# Altium schematic sheet PCIE Connector.SchDoc
size 420 x 297 mm; Author: ALTIUM GOSTBOM2.0 KEV; SheetNumber: 16; SheetTotal: 48
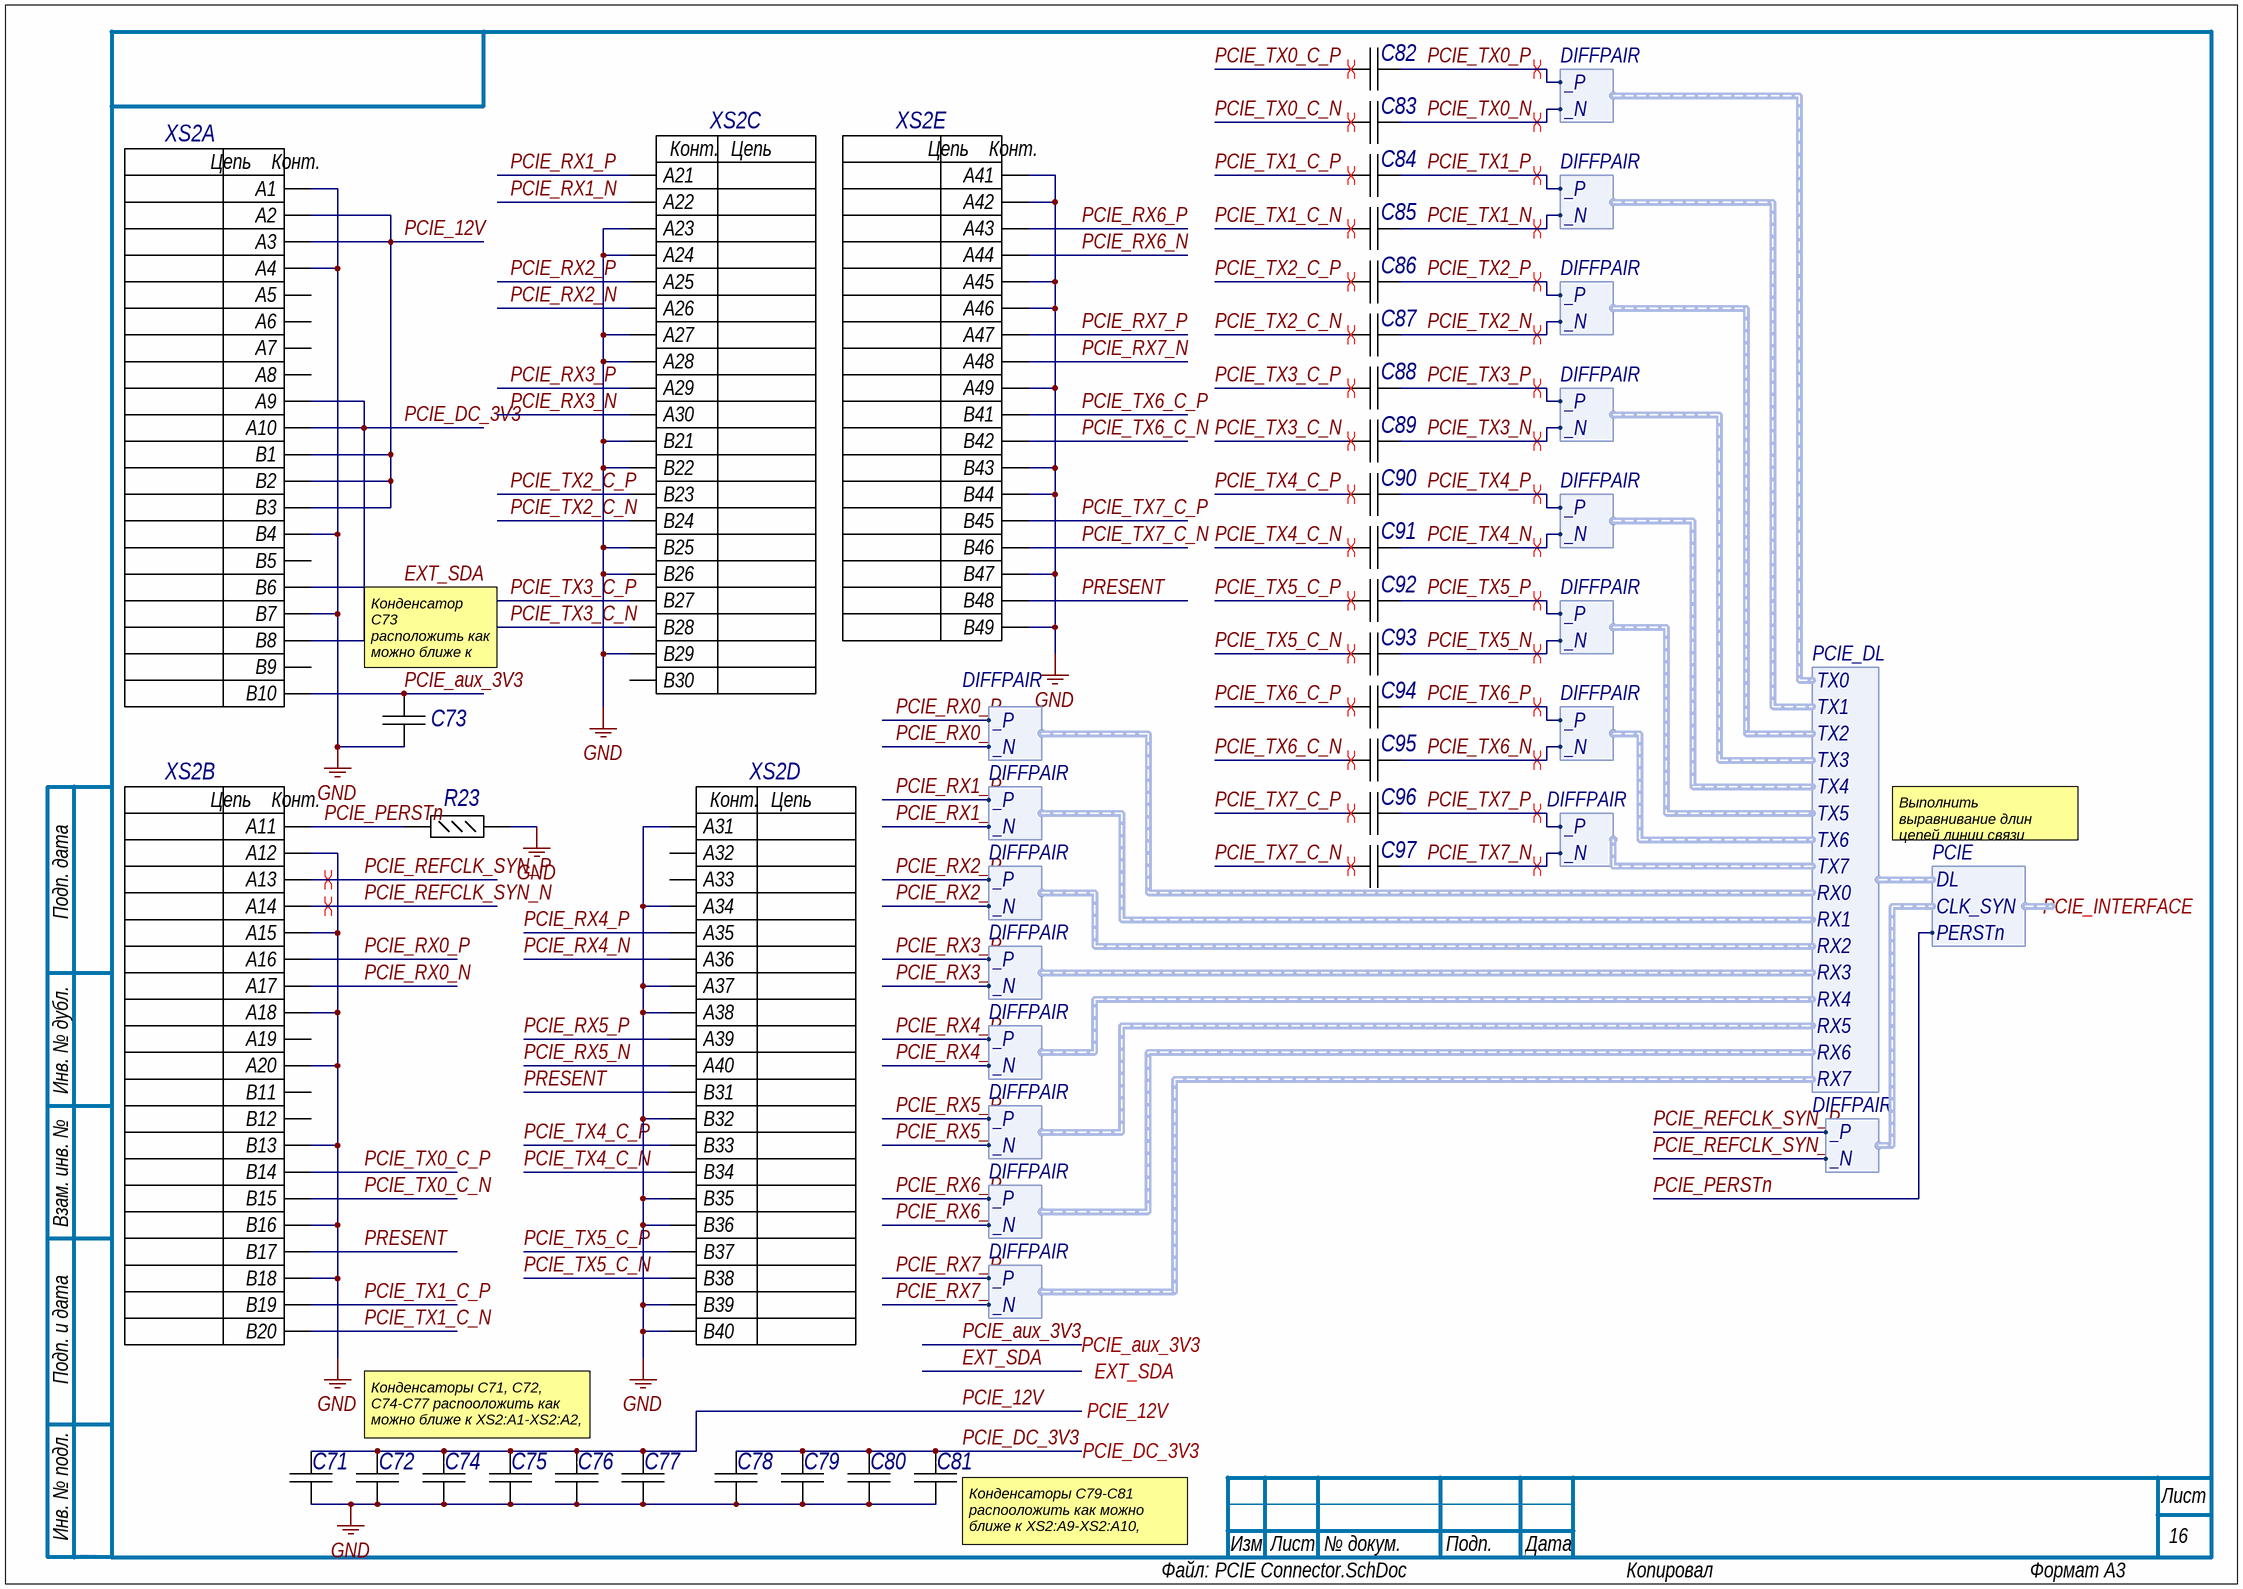
[diagram p0: PCIE Connector.SchDoc]

## Parts
C71  GRM31CR61E226KE15L  [CAPC3216X180X55ML20T25]  (value not drawn)
C72  C1005X7R1E104M  [CAPC1005X55X10LL05]  (value not drawn)
C73  C1005X7R1E104M  [CAPC1005X55X10LL05]  (value not drawn)
C74  C1005X7R1E104M  [CAPC1005X55X10LL05]  (value not drawn)
C75  C1005X7R1E104M  [CAPC1005X55X10LL05]  (value not drawn)
C76  C1005X7R1E104M  [CAPC1005X55X10LL05]  (value not drawn)
C77  C1005X7R1E104M  [CAPC1005X55X10LL05]  (value not drawn)
C78  C1005X7R1E104M  [CAPC1005X55X10LL05]  (value not drawn)
C79  C1005X7R1E104M  [CAPC1005X55X10LL05]  (value not drawn)
C80  C1005X7R1E104M  [CAPC1005X55X10LL05]  (value not drawn)
C81  GRM31CR60J107ME39L  [CAPC3216X190X55ML30T25]  (value not drawn)
C82  GRM155R61A224KE19D  [CAPC1005X55X25NL05T10]  (value not drawn)
C83  GRM155R61A224KE19D  [CAPC1005X55X25NL05T10]  (value not drawn)
C84  GRM155R61A224KE19D  [CAPC1005X55X25NL05T10]  (value not drawn)
C85  GRM155R61A224KE19D  [CAPC1005X55X25NL05T10]  (value not drawn)
C86  GRM155R61A224KE19D  [CAPC1005X55X25NL05T10]  (value not drawn)
C87  GRM155R61A224KE19D  [CAPC1005X55X25NL05T10]  (value not drawn)
C88  GRM155R61A224KE19D  [CAPC1005X55X25NL05T10]  (value not drawn)
C89  GRM155R61A224KE19D  [CAPC1005X55X25NL05T10]  (value not drawn)
C90  GRM155R61A224KE19D  [CAPC1005X55X25NL05T10]  (value not drawn)
C91  GRM155R61A224KE19D  [CAPC1005X55X25NL05T10]  (value not drawn)
C92  GRM155R61A224KE19D  [CAPC1005X55X25NL05T10]  (value not drawn)
C93  GRM155R61A224KE19D  [CAPC1005X55X25NL05T10]  (value not drawn)
C94  GRM155R61A224KE19D  [CAPC1005X55X25NL05T10]  (value not drawn)
C95  GRM155R61A224KE19D  [CAPC1005X55X25NL05T10]  (value not drawn)
C96  GRM155R61A224KE19D  [CAPC1005X55X25NL05T10]  (value not drawn)
C97  GRM155R61A224KE19D  [CAPC1005X55X25NL05T10]  (value not drawn)
R23  ERJ-2RKF4701X  [RESC1005X40X25LL05T05]  (value not drawn)
XS2  PCIE-098-02-F-D-TH  [SMTC-PCIE-098-02-F-D-TH_V]  (value not drawn)  (parts A,B,C,D,E of 5)

## Ports
EXT_SDA, PCIE_12V, PCIE_aux_3V3, PCIE_DC_3V3, PCIE_INTERFACE (harness PCIE)

## Harnesses
PCIE_DL: RX0, RX1, RX2, RX3, RX4, RX5, RX6, RX7, TX0, TX1, TX2, TX3, TX4, TX5, TX6, TX7
DIFFPAIR: _P, _N
PCIE: DL, CLK_SYN, PERSTn

## Nets
GND: C71.1 C72.1 C73.1 C74.1 C75.1 C76.1 C77.1 C78.1 C79.1 C80.1 C81.1 R23.2 XS2.A1 XS2.A4 XS2.A12 XS2.A15 XS2.A18 XS2.A20 XS2.A23 XS2.A24 XS2.A27 XS2.A28 XS2.A31 XS2.A34 XS2.A37 XS2.A38 XS2.A41 XS2.A42 XS2.A45 XS2.A46 XS2.A49 XS2.B4 XS2.B7 XS2.B13 XS2.B16 XS2.B18 XS2.B21 XS2.B22 XS2.B25 XS2.B26 XS2.B29 XS2.B32 XS2.B35 XS2.B36 XS2.B39 XS2.B40 XS2.B43 XS2.B44 XS2.B47 XS2.B49
EXT_SDA: XS2.B6 ; port EXT_SDA
PCIE_12V: C71.2 C72.2 C74.2 C75.2 C76.2 C77.2 XS2.A2 XS2.A3 XS2.B1 XS2.B2 XS2.B3 ; port PCIE_12V
PCIE_aux_3V3: C73.2 XS2.B10 ; port PCIE_aux_3V3
PCIE_DC_3V3: C78.2 C79.2 C80.2 C81.2 XS2.A9 XS2.A10 XS2.B8 ; port PCIE_DC_3V3
PCIE_PERSTn: R23.1 XS2.A11 ; port PCIE_INTERFACE.PERSTn
PCIE_REFCLK_SYN_N: XS2.A14 ; harness DIFFPAIR._N
PCIE_REFCLK_SYN_P: XS2.A13 ; harness DIFFPAIR._P
PCIE_RX0_N: XS2.A17 ; harness DIFFPAIR._N
PCIE_RX0_P: XS2.A16 ; harness DIFFPAIR._P
PCIE_RX1_N: XS2.A22 ; harness DIFFPAIR._N
PCIE_RX1_P: XS2.A21 ; harness DIFFPAIR._P
PCIE_RX2_N: XS2.A26 ; harness DIFFPAIR._N
PCIE_RX2_P: XS2.A25 ; harness DIFFPAIR._P
PCIE_RX3_N: XS2.A30 ; harness DIFFPAIR._N
PCIE_RX3_P: XS2.A29 ; harness DIFFPAIR._P
PCIE_RX4_N: XS2.A36 ; harness DIFFPAIR._N
PCIE_RX4_P: XS2.A35 ; harness DIFFPAIR._P
PCIE_RX5_N: XS2.A40 ; harness DIFFPAIR._N
PCIE_RX5_P: XS2.A39 ; harness DIFFPAIR._P
PCIE_RX6_N: XS2.A44 ; harness DIFFPAIR._N
PCIE_RX6_P: XS2.A43 ; harness DIFFPAIR._P
PCIE_RX7_N: XS2.A48 ; harness DIFFPAIR._N
PCIE_RX7_P: XS2.A47 ; harness DIFFPAIR._P
PCIE_TX0_C_N: C83.2 XS2.B15
PCIE_TX0_C_P: C82.2 XS2.B14
PCIE_TX0_N: C83.1 ; harness DIFFPAIR._N
PCIE_TX0_P: C82.1 ; harness DIFFPAIR._P
PCIE_TX1_C_N: C85.2 XS2.B20
PCIE_TX1_C_P: C84.2 XS2.B19
PCIE_TX1_N: C85.1 ; harness DIFFPAIR._N
PCIE_TX1_P: C84.1 ; harness DIFFPAIR._P
PCIE_TX2_C_N: C87.2 XS2.B24
PCIE_TX2_C_P: C86.2 XS2.B23
PCIE_TX2_N: C87.1 ; harness DIFFPAIR._N
PCIE_TX2_P: C86.1 ; harness DIFFPAIR._P
PCIE_TX3_C_N: C89.2 XS2.B28
PCIE_TX3_C_P: C88.2 XS2.B27
PCIE_TX3_N: C89.1 ; harness DIFFPAIR._N
PCIE_TX3_P: C88.1 ; harness DIFFPAIR._P
PCIE_TX4_C_N: C91.2 XS2.B34
PCIE_TX4_C_P: C90.2 XS2.B33
PCIE_TX4_N: C91.1 ; harness DIFFPAIR._N
PCIE_TX4_P: C90.1 ; harness DIFFPAIR._P
PCIE_TX5_C_N: C93.2 XS2.B38
PCIE_TX5_C_P: C92.2 XS2.B37
PCIE_TX5_N: C93.1 ; harness DIFFPAIR._N
PCIE_TX5_P: C92.1 ; harness DIFFPAIR._P
PCIE_TX6_C_N: C95.2 XS2.B42
PCIE_TX6_C_P: C94.2 XS2.B41
PCIE_TX6_N: C95.1 ; harness DIFFPAIR._N
PCIE_TX6_P: C94.1 ; harness DIFFPAIR._P
PCIE_TX7_C_N: C97.2 XS2.B46
PCIE_TX7_C_P: C96.2 XS2.B45
PCIE_TX7_N: C97.1 ; harness DIFFPAIR._N
PCIE_TX7_P: C96.1 ; harness DIFFPAIR._P
PRESENT: XS2.B17 XS2.B31 XS2.B48

Not connected (* = marked no-connect by the designer): XS2 A5 A6 A7 A8 A19 A32 A33 B5 B9 B11 B12 B30

## Layout directives
differential pair: PCIE_REFCLK_SYN_N, PCIE_REFCLK_SYN_P, PCIE_TX0_C_N, PCIE_TX0_C_P, PCIE_TX0_N, PCIE_TX0_P, PCIE_TX1_C_N, PCIE_TX1_C_P, PCIE_TX1_N, PCIE_TX1_P, PCIE_TX2_C_N, PCIE_TX2_C_P, PCIE_TX2_N, PCIE_TX2_P, PCIE_TX3_C_N, PCIE_TX3_C_P, PCIE_TX3_N, PCIE_TX3_P, PCIE_TX4_C_N, PCIE_TX4_C_P, PCIE_TX4_N, PCIE_TX4_P, PCIE_TX5_C_N, PCIE_TX5_C_P, PCIE_TX5_N, PCIE_TX5_P, PCIE_TX6_C_N, PCIE_TX6_C_P, PCIE_TX6_N, PCIE_TX6_P, PCIE_TX7_C_N, PCIE_TX7_C_P, PCIE_TX7_N, PCIE_TX7_P

## Notes on the sheet
- (near C73) Конденсатор C73 расположить как можно ближе к XS2:B10.
- Выполнить выравнивание длин цепей линии связи PCIE.DL.
- Конденсаторы C71, C72, C74-C77 распооложить как можно ближе к XS2:A1-XS2:A2, XS2:B1-XS2:B3.
- (near C81) Конденсаторы C79-C81 распооложить как можно ближе к XS2:A9-XS2:A10, XS2:B8.
- Подп. дата
- Инв. № дубл.
- Взам. инв. №
- Подп. и дата
- Инв. № подл.
- Изм.
- Лист
- № докум.
- Подп.
- Дата
- ALTIUM GOSTBOM2.0 KEV
- Файл:
- Копировал
- Формат А3
- (in symbol E41, part A) Цепь; Конт.
- (in symbol E41, part B) Цепь; Конт.
- (in symbol E41, part C) Конт.; Цепь
- (in symbol E41, part D) Конт.; Цепь
- (in symbol E41, part E) Цепь; Конт.

## Library data of the parts
C71 = E5: Chip Capacitor, 22 uF, +/- 10%, 25 V, -55 to 85 degC, 1206 (3216 Metric), RoHS, Tape and Reel; Тип элемента: Конденсатор; Capacitance: 22 uF; Case\/Package: 1206; Type (Capacitors): X5R; Voltage Rating: 25 V; Old_des: C500; New_des: C71; UID: E5; Component Kind: Standard; Case Code (Imperial): 1206; Case Code (Metric): 3216; ComponentLink1Description: Manufacturer URL; ComponentLink1URL: http://www.murata.com/; ComponentLink2Description: Datasheet; ComponentLink2URL: http://search.murata.co.jp/Ceramy/image/img/A01X/G101/ENG/GRM31CR61E226KE15-01.pdf; DatasheetVersion: 03/2016; Length: 3.2 mm; Max Operating Temperature: 85 degC; Min Operating Temperature: -55 degC; Mounting Technology: Surface Mount; Package Quantity: 2000; PackageDescription: 2-Pin Surface Mount Device, Body 3.2 x 1.6 mm; Packaging: Tape and Reel; PartNumber: GRM31CR61E226KE15L; RoHSCompliant: true; Tolerance: 10%; Width: 1.6 mm; Height: 1.6 mm; Mount: Surface Mount; PackageReference: 1206; Pins: 2; Radiation Hardening: No; REACH SVHC: No SVHC; Voltage Rating (DC): 25 V
C72 = E11: Chip Capacitor, 0.1 uF, +/- 20%, 25 V, -55 to 125 degC, 0402 (1005 Metric), RoHS, Tape and Reel; Тип элемента: Конденсатор; Capacitance: 100 nF; Case\/Package: 0402; Type (Capacitors): X7R; Voltage Rating: 25 V; Old_des: C501; New_des: C72; UID: E11; Component Kind: Standard; Case Code (Imperial): 0402; Case Code (Metric): 1005; ComponentLink1Description: Manufacturer URL; ComponentLink1URL: http://www.tdk.com/; ComponentLink2Description: Datasheet; ComponentLink2URL: http://www.farnell.com/datasheets/1571323.pdf; DatasheetVersion: 09/2011; Length: 1 mm; Max Operating Temperature: 125 degC; Min Operating Temperature: -55 degC; Mounting Technology: Surface Mount; Package Quantity: 10000; PackageDescription: 2-Pin Surface Mount Device, Body 1 x 0.5 mm; Packaging: Tape and Reel; PartNumber: C1005X7R1E104M; RoHSCompliant: true; Tolerance: 20%; Width: 0.5 mm; Height: 0.5 mm; Mount: Surface Mount; PackageReference: 0402; Pins: 2; Voltage Rating (DC): 25 V
C73 = E11: Chip Capacitor, 0.1 uF, +/- 20%, 25 V, -55 to 125 degC, 0402 (1005 Metric), RoHS, Tape and Reel; Тип элемента: Конденсатор; Capacitance: 100 nF; Case\/Package: 0402; Type (Capacitors): X7R; Voltage Rating: 25 V; Old_des: C483; New_des: C73; UID: E11; Component Kind: Standard; Case Code (Imperial): 0402; Case Code (Metric): 1005; ComponentLink1Description: Manufacturer URL; ComponentLink1URL: http://www.tdk.com/; ComponentLink2Description: Datasheet; ComponentLink2URL: http://www.farnell.com/datasheets/1571323.pdf; DatasheetVersion: 09/2011; Length: 1 mm; Max Operating Temperature: 125 degC; Min Operating Temperature: -55 degC; Mounting Technology: Surface Mount; Package Quantity: 10000; PackageDescription: 2-Pin Surface Mount Device, Body 1 x 0.5 mm; Packaging: Tape and Reel; PartNumber: C1005X7R1E104M; RoHSCompliant: true; Tolerance: 20%; Width: 0.5 mm; Height: 0.5 mm; Mount: Surface Mount; PackageReference: 0402; Pins: 2; Voltage Rating (DC): 25 V
C74 = E11: Chip Capacitor, 0.1 uF, +/- 20%, 25 V, -55 to 125 degC, 0402 (1005 Metric), RoHS, Tape and Reel; Тип элемента: Конденсатор; Capacitance: 100 nF; Case\/Package: 0402; Type (Capacitors): X7R; Voltage Rating: 25 V; Old_des: C502; New_des: C74; UID: E11; Component Kind: Standard; Case Code (Imperial): 0402; Case Code (Metric): 1005; ComponentLink1Description: Manufacturer URL; ComponentLink1URL: http://www.tdk.com/; ComponentLink2Description: Datasheet; ComponentLink2URL: http://www.farnell.com/datasheets/1571323.pdf; DatasheetVersion: 09/2011; Length: 1 mm; Max Operating Temperature: 125 degC; Min Operating Temperature: -55 degC; Mounting Technology: Surface Mount; Package Quantity: 10000; PackageDescription: 2-Pin Surface Mount Device, Body 1 x 0.5 mm; Packaging: Tape and Reel; PartNumber: C1005X7R1E104M; RoHSCompliant: true; Tolerance: 20%; Width: 0.5 mm; Height: 0.5 mm; Mount: Surface Mount; PackageReference: 0402; Pins: 2; Voltage Rating (DC): 25 V
C75 = E11: Chip Capacitor, 0.1 uF, +/- 20%, 25 V, -55 to 125 degC, 0402 (1005 Metric), RoHS, Tape and Reel; Тип элемента: Конденсатор; Capacitance: 100 nF; Case\/Package: 0402; Type (Capacitors): X7R; Voltage Rating: 25 V; Old_des: C503; New_des: C75; UID: E11; Component Kind: Standard; Case Code (Imperial): 0402; Case Code (Metric): 1005; ComponentLink1Description: Manufacturer URL; ComponentLink1URL: http://www.tdk.com/; ComponentLink2Description: Datasheet; ComponentLink2URL: http://www.farnell.com/datasheets/1571323.pdf; DatasheetVersion: 09/2011; Length: 1 mm; Max Operating Temperature: 125 degC; Min Operating Temperature: -55 degC; Mounting Technology: Surface Mount; Package Quantity: 10000; PackageDescription: 2-Pin Surface Mount Device, Body 1 x 0.5 mm; Packaging: Tape and Reel; PartNumber: C1005X7R1E104M; RoHSCompliant: true; Tolerance: 20%; Width: 0.5 mm; Height: 0.5 mm; Mount: Surface Mount; PackageReference: 0402; Pins: 2; Voltage Rating (DC): 25 V
C76 = E11: Chip Capacitor, 0.1 uF, +/- 20%, 25 V, -55 to 125 degC, 0402 (1005 Metric), RoHS, Tape and Reel; Тип элемента: Конденсатор; Capacitance: 100 nF; Case\/Package: 0402; Type (Capacitors): X7R; Voltage Rating: 25 V; Old_des: C504; New_des: C76; UID: E11; Component Kind: Standard; Case Code (Imperial): 0402; Case Code (Metric): 1005; ComponentLink1Description: Manufacturer URL; ComponentLink1URL: http://www.tdk.com/; ComponentLink2Description: Datasheet; ComponentLink2URL: http://www.farnell.com/datasheets/1571323.pdf; DatasheetVersion: 09/2011; Length: 1 mm; Max Operating Temperature: 125 degC; Min Operating Temperature: -55 degC; Mounting Technology: Surface Mount; Package Quantity: 10000; PackageDescription: 2-Pin Surface Mount Device, Body 1 x 0.5 mm; Packaging: Tape and Reel; PartNumber: C1005X7R1E104M; RoHSCompliant: true; Tolerance: 20%; Width: 0.5 mm; Height: 0.5 mm; Mount: Surface Mount; PackageReference: 0402; Pins: 2; Voltage Rating (DC): 25 V
C77 = E11: Chip Capacitor, 0.1 uF, +/- 20%, 25 V, -55 to 125 degC, 0402 (1005 Metric), RoHS, Tape and Reel; Тип элемента: Конденсатор; Capacitance: 100 nF; Case\/Package: 0402; Type (Capacitors): X7R; Voltage Rating: 25 V; Old_des: C505; New_des: C77; UID: E11; Component Kind: Standard; Case Code (Imperial): 0402; Case Code (Metric): 1005; ComponentLink1Description: Manufacturer URL; ComponentLink1URL: http://www.tdk.com/; ComponentLink2Description: Datasheet; ComponentLink2URL: http://www.farnell.com/datasheets/1571323.pdf; DatasheetVersion: 09/2011; Length: 1 mm; Max Operating Temperature: 125 degC; Min Operating Temperature: -55 degC; Mounting Technology: Surface Mount; Package Quantity: 10000; PackageDescription: 2-Pin Surface Mount Device, Body 1 x 0.5 mm; Packaging: Tape and Reel; PartNumber: C1005X7R1E104M; RoHSCompliant: true; Tolerance: 20%; Width: 0.5 mm; Height: 0.5 mm; Mount: Surface Mount; PackageReference: 0402; Pins: 2; Voltage Rating (DC): 25 V
C78 = E11: Chip Capacitor, 0.1 uF, +/- 20%, 25 V, -55 to 125 degC, 0402 (1005 Metric), RoHS, Tape and Reel; Тип элемента: Конденсатор; Capacitance: 100 nF; Case\/Package: 0402; Type (Capacitors): X7R; Voltage Rating: 25 V; Old_des: C506; New_des: C78; UID: E11; Component Kind: Standard; Case Code (Imperial): 0402; Case Code (Metric): 1005; ComponentLink1Description: Manufacturer URL; ComponentLink1URL: http://www.tdk.com/; ComponentLink2Description: Datasheet; ComponentLink2URL: http://www.farnell.com/datasheets/1571323.pdf; DatasheetVersion: 09/2011; Length: 1 mm; Max Operating Temperature: 125 degC; Min Operating Temperature: -55 degC; Mounting Technology: Surface Mount; Package Quantity: 10000; PackageDescription: 2-Pin Surface Mount Device, Body 1 x 0.5 mm; Packaging: Tape and Reel; PartNumber: C1005X7R1E104M; RoHSCompliant: true; Tolerance: 20%; Width: 0.5 mm; Height: 0.5 mm; Mount: Surface Mount; PackageReference: 0402; Pins: 2; Voltage Rating (DC): 25 V
C79 = E11: Chip Capacitor, 0.1 uF, +/- 20%, 25 V, -55 to 125 degC, 0402 (1005 Metric), RoHS, Tape and Reel; Тип элемента: Конденсатор; Capacitance: 100 nF; Case\/Package: 0402; Type (Capacitors): X7R; Voltage Rating: 25 V; Old_des: C507; New_des: C79; UID: E11; Component Kind: Standard; Case Code (Imperial): 0402; Case Code (Metric): 1005; ComponentLink1Description: Manufacturer URL; ComponentLink1URL: http://www.tdk.com/; ComponentLink2Description: Datasheet; ComponentLink2URL: http://www.farnell.com/datasheets/1571323.pdf; DatasheetVersion: 09/2011; Length: 1 mm; Max Operating Temperature: 125 degC; Min Operating Temperature: -55 degC; Mounting Technology: Surface Mount; Package Quantity: 10000; PackageDescription: 2-Pin Surface Mount Device, Body 1 x 0.5 mm; Packaging: Tape and Reel; PartNumber: C1005X7R1E104M; RoHSCompliant: true; Tolerance: 20%; Width: 0.5 mm; Height: 0.5 mm; Mount: Surface Mount; PackageReference: 0402; Pins: 2; Voltage Rating (DC): 25 V
C80 = E11: Chip Capacitor, 0.1 uF, +/- 20%, 25 V, -55 to 125 degC, 0402 (1005 Metric), RoHS, Tape and Reel; Тип элемента: Конденсатор; Capacitance: 100 nF; Case\/Package: 0402; Type (Capacitors): X7R; Voltage Rating: 25 V; Old_des: C508; New_des: C80; UID: E11; Component Kind: Standard; Case Code (Imperial): 0402; Case Code (Metric): 1005; ComponentLink1Description: Manufacturer URL; ComponentLink1URL: http://www.tdk.com/; ComponentLink2Description: Datasheet; ComponentLink2URL: http://www.farnell.com/datasheets/1571323.pdf; DatasheetVersion: 09/2011; Length: 1 mm; Max Operating Temperature: 125 degC; Min Operating Temperature: -55 degC; Mounting Technology: Surface Mount; Package Quantity: 10000; PackageDescription: 2-Pin Surface Mount Device, Body 1 x 0.5 mm; Packaging: Tape and Reel; PartNumber: C1005X7R1E104M; RoHSCompliant: true; Tolerance: 20%; Width: 0.5 mm; Height: 0.5 mm; Mount: Surface Mount; PackageReference: 0402; Pins: 2; Voltage Rating (DC): 25 V
C81 = E14: Chip Capacitor, 100 uF, +/- 20%, 6.3 V, -55 to 85 degC, 1206 (3216 Metric), RoHS, Tape and Reel; Тип элемента: Конденсатор; Capacitance: 100 uF; Case\/Package: 1206; Type (Capacitors): X5R; Voltage Rating: 6.3 V; Old_des: C509; New_des: C81; UID: E14; Component Kind: Standard; Case Code (Imperial): 1206; Case Code (Metric): 3216; ComponentLink1Description: Manufacturer URL; ComponentLink1URL: http://www.murata.com/; ComponentLink2Description: Datasheet; ComponentLink2URL: http://psearch.en.murata.com/capacitor/product/GRM31CR60J107ME39%23.pdf; DatasheetVersion: 09/2016; Length: 3.2 mm; Max Operating Temperature: 85 degC; Min Operating Temperature: -55 degC; Mounting Technology: Surface Mount; Package Quantity: 2000; PackageDescription: 2-Pin Surface Mount Device, Body 3.2 x 1.6 mm; Packaging: Tape and Reel; PartNumber: GRM31CR60J107ME39L; RoHSCompliant: true; Tolerance: 20%; Width: 1.6 mm; Height: 1.6 mm; Mount: Surface Mount; PackageReference: 1206; Pins: 2; Radiation Hardening: No; REACH SVHC: No SVHC; Voltage Rating (DC): 6.3 V
C82 = E7: Chip Capacitor, 220 nF, +/- 10%, 10 V, -55 to 85 degC, 0402 (1005 Metric), RoHS, Tape and Reel; Manufacturer: Basic Passives; Тип элемента: Конденсатор; Capacitance: 220 nF; Case\/Package: 0402; Type (Capacitors): X5R; Voltage Rating: 10 V; Old_des: C484; New_des: C82; UID: E7; Component Kind: Standard; Case Code (Imperial): 0402; Case Code (Metric): 1005; ComponentLink1Description: Manufacturer URL; ComponentLink1URL: http://www.murata.com/; ComponentLink2Description: Datasheet; ComponentLink2URL: http://search.murata.co.jp/Ceramy/image/img/A01X/G101/ENG/GRM155R61A224KE19-01.pdf; DatasheetVersion: 03/2016; Length: 1 mm; Max Operating Temperature: 85 degC; Min Operating Temperature: -55 degC; Mounting Technology: Surface Mount; Package Quantity: 1; PackageDescription: 2-Pin Surface Mount Device, Body 1 x 0.5 mm; Packaging: Tape and Reel; PartNumber: GRM155R61A224KE19D; RoHSCompliant: true; Tolerance: 10%; Width: 0.5 mm; Height: 0.5 mm; Mount: Surface Mount; PackageReference: 0402; Pins: 2; Radiation Hardening: No; REACH SVHC: No SVHC; Voltage Rating (DC): 10 V
C83 = E7: Chip Capacitor, 220 nF, +/- 10%, 10 V, -55 to 85 degC, 0402 (1005 Metric), RoHS, Tape and Reel; Manufacturer: Basic Passives; Тип элемента: Конденсатор; Capacitance: 220 nF; Case\/Package: 0402; Type (Capacitors): X5R; Voltage Rating: 10 V; Old_des: C485; New_des: C83; UID: E7; Component Kind: Standard; Case Code (Imperial): 0402; Case Code (Metric): 1005; ComponentLink1Description: Manufacturer URL; ComponentLink1URL: http://www.murata.com/; ComponentLink2Description: Datasheet; ComponentLink2URL: http://search.murata.co.jp/Ceramy/image/img/A01X/G101/ENG/GRM155R61A224KE19-01.pdf; DatasheetVersion: 03/2016; Length: 1 mm; Max Operating Temperature: 85 degC; Min Operating Temperature: -55 degC; Mounting Technology: Surface Mount; Package Quantity: 1; PackageDescription: 2-Pin Surface Mount Device, Body 1 x 0.5 mm; Packaging: Tape and Reel; PartNumber: GRM155R61A224KE19D; RoHSCompliant: true; Tolerance: 10%; Width: 0.5 mm; Height: 0.5 mm; Mount: Surface Mount; PackageReference: 0402; Pins: 2; Radiation Hardening: No; REACH SVHC: No SVHC; Voltage Rating (DC): 10 V
C84 = E7: Chip Capacitor, 220 nF, +/- 10%, 10 V, -55 to 85 degC, 0402 (1005 Metric), RoHS, Tape and Reel; Manufacturer: Basic Passives; Тип элемента: Конденсатор; Capacitance: 220 nF; Case\/Package: 0402; Type (Capacitors): X5R; Voltage Rating: 10 V; Old_des: C486; New_des: C84; UID: E7; Component Kind: Standard; Case Code (Imperial): 0402; Case Code (Metric): 1005; ComponentLink1Description: Manufacturer URL; ComponentLink1URL: http://www.murata.com/; ComponentLink2Description: Datasheet; ComponentLink2URL: http://search.murata.co.jp/Ceramy/image/img/A01X/G101/ENG/GRM155R61A224KE19-01.pdf; DatasheetVersion: 03/2016; Length: 1 mm; Max Operating Temperature: 85 degC; Min Operating Temperature: -55 degC; Mounting Technology: Surface Mount; Package Quantity: 1; PackageDescription: 2-Pin Surface Mount Device, Body 1 x 0.5 mm; Packaging: Tape and Reel; PartNumber: GRM155R61A224KE19D; RoHSCompliant: true; Tolerance: 10%; Width: 0.5 mm; Height: 0.5 mm; Mount: Surface Mount; PackageReference: 0402; Pins: 2; Radiation Hardening: No; REACH SVHC: No SVHC; Voltage Rating (DC): 10 V
C85 = E7: Chip Capacitor, 220 nF, +/- 10%, 10 V, -55 to 85 degC, 0402 (1005 Metric), RoHS, Tape and Reel; Manufacturer: Basic Passives; Тип элемента: Конденсатор; Capacitance: 220 nF; Case\/Package: 0402; Type (Capacitors): X5R; Voltage Rating: 10 V; Old_des: C487; New_des: C85; UID: E7; Component Kind: Standard; Case Code (Imperial): 0402; Case Code (Metric): 1005; ComponentLink1Description: Manufacturer URL; ComponentLink1URL: http://www.murata.com/; ComponentLink2Description: Datasheet; ComponentLink2URL: http://search.murata.co.jp/Ceramy/image/img/A01X/G101/ENG/GRM155R61A224KE19-01.pdf; DatasheetVersion: 03/2016; Length: 1 mm; Max Operating Temperature: 85 degC; Min Operating Temperature: -55 degC; Mounting Technology: Surface Mount; Package Quantity: 1; PackageDescription: 2-Pin Surface Mount Device, Body 1 x 0.5 mm; Packaging: Tape and Reel; PartNumber: GRM155R61A224KE19D; RoHSCompliant: true; Tolerance: 10%; Width: 0.5 mm; Height: 0.5 mm; Mount: Surface Mount; PackageReference: 0402; Pins: 2; Radiation Hardening: No; REACH SVHC: No SVHC; Voltage Rating (DC): 10 V
C86 = E7: Chip Capacitor, 220 nF, +/- 10%, 10 V, -55 to 85 degC, 0402 (1005 Metric), RoHS, Tape and Reel; Manufacturer: Basic Passives; Тип элемента: Конденсатор; Capacitance: 220 nF; Case\/Package: 0402; Type (Capacitors): X5R; Voltage Rating: 10 V; Old_des: C488; New_des: C86; UID: E7; Component Kind: Standard; Case Code (Imperial): 0402; Case Code (Metric): 1005; ComponentLink1Description: Manufacturer URL; ComponentLink1URL: http://www.murata.com/; ComponentLink2Description: Datasheet; ComponentLink2URL: http://search.murata.co.jp/Ceramy/image/img/A01X/G101/ENG/GRM155R61A224KE19-01.pdf; DatasheetVersion: 03/2016; Length: 1 mm; Max Operating Temperature: 85 degC; Min Operating Temperature: -55 degC; Mounting Technology: Surface Mount; Package Quantity: 1; PackageDescription: 2-Pin Surface Mount Device, Body 1 x 0.5 mm; Packaging: Tape and Reel; PartNumber: GRM155R61A224KE19D; RoHSCompliant: true; Tolerance: 10%; Width: 0.5 mm; Height: 0.5 mm; Mount: Surface Mount; PackageReference: 0402; Pins: 2; Radiation Hardening: No; REACH SVHC: No SVHC; Voltage Rating (DC): 10 V
C87 = E7: Chip Capacitor, 220 nF, +/- 10%, 10 V, -55 to 85 degC, 0402 (1005 Metric), RoHS, Tape and Reel; Manufacturer: Basic Passives; Тип элемента: Конденсатор; Capacitance: 220 nF; Case\/Package: 0402; Type (Capacitors): X5R; Voltage Rating: 10 V; Old_des: C489; New_des: C87; UID: E7; Component Kind: Standard; Case Code (Imperial): 0402; Case Code (Metric): 1005; ComponentLink1Description: Manufacturer URL; ComponentLink1URL: http://www.murata.com/; ComponentLink2Description: Datasheet; ComponentLink2URL: http://search.murata.co.jp/Ceramy/image/img/A01X/G101/ENG/GRM155R61A224KE19-01.pdf; DatasheetVersion: 03/2016; Length: 1 mm; Max Operating Temperature: 85 degC; Min Operating Temperature: -55 degC; Mounting Technology: Surface Mount; Package Quantity: 1; PackageDescription: 2-Pin Surface Mount Device, Body 1 x 0.5 mm; Packaging: Tape and Reel; PartNumber: GRM155R61A224KE19D; RoHSCompliant: true; Tolerance: 10%; Width: 0.5 mm; Height: 0.5 mm; Mount: Surface Mount; PackageReference: 0402; Pins: 2; Radiation Hardening: No; REACH SVHC: No SVHC; Voltage Rating (DC): 10 V
C88 = E7: Chip Capacitor, 220 nF, +/- 10%, 10 V, -55 to 85 degC, 0402 (1005 Metric), RoHS, Tape and Reel; Manufacturer: Basic Passives; Тип элемента: Конденсатор; Capacitance: 220 nF; Case\/Package: 0402; Type (Capacitors): X5R; Voltage Rating: 10 V; Old_des: C490; New_des: C88; UID: E7; Component Kind: Standard; Case Code (Imperial): 0402; Case Code (Metric): 1005; ComponentLink1Description: Manufacturer URL; ComponentLink1URL: http://www.murata.com/; ComponentLink2Description: Datasheet; ComponentLink2URL: http://search.murata.co.jp/Ceramy/image/img/A01X/G101/ENG/GRM155R61A224KE19-01.pdf; DatasheetVersion: 03/2016; Length: 1 mm; Max Operating Temperature: 85 degC; Min Operating Temperature: -55 degC; Mounting Technology: Surface Mount; Package Quantity: 1; PackageDescription: 2-Pin Surface Mount Device, Body 1 x 0.5 mm; Packaging: Tape and Reel; PartNumber: GRM155R61A224KE19D; RoHSCompliant: true; Tolerance: 10%; Width: 0.5 mm; Height: 0.5 mm; Mount: Surface Mount; PackageReference: 0402; Pins: 2; Radiation Hardening: No; REACH SVHC: No SVHC; Voltage Rating (DC): 10 V
C89 = E7: Chip Capacitor, 220 nF, +/- 10%, 10 V, -55 to 85 degC, 0402 (1005 Metric), RoHS, Tape and Reel; Manufacturer: Basic Passives; Тип элемента: Конденсатор; Capacitance: 220 nF; Case\/Package: 0402; Type (Capacitors): X5R; Voltage Rating: 10 V; Old_des: C491; New_des: C89; UID: E7; Component Kind: Standard; Case Code (Imperial): 0402; Case Code (Metric): 1005; ComponentLink1Description: Manufacturer URL; ComponentLink1URL: http://www.murata.com/; ComponentLink2Description: Datasheet; ComponentLink2URL: http://search.murata.co.jp/Ceramy/image/img/A01X/G101/ENG/GRM155R61A224KE19-01.pdf; DatasheetVersion: 03/2016; Length: 1 mm; Max Operating Temperature: 85 degC; Min Operating Temperature: -55 degC; Mounting Technology: Surface Mount; Package Quantity: 1; PackageDescription: 2-Pin Surface Mount Device, Body 1 x 0.5 mm; Packaging: Tape and Reel; PartNumber: GRM155R61A224KE19D; RoHSCompliant: true; Tolerance: 10%; Width: 0.5 mm; Height: 0.5 mm; Mount: Surface Mount; PackageReference: 0402; Pins: 2; Radiation Hardening: No; REACH SVHC: No SVHC; Voltage Rating (DC): 10 V
C90 = E7: Chip Capacitor, 220 nF, +/- 10%, 10 V, -55 to 85 degC, 0402 (1005 Metric), RoHS, Tape and Reel; Manufacturer: Basic Passives; Тип элемента: Конденсатор; Capacitance: 220 nF; Case\/Package: 0402; Type (Capacitors): X5R; Voltage Rating: 10 V; Old_des: C492; New_des: C90; UID: E7; Component Kind: Standard; Case Code (Imperial): 0402; Case Code (Metric): 1005; ComponentLink1Description: Manufacturer URL; ComponentLink1URL: http://www.murata.com/; ComponentLink2Description: Datasheet; ComponentLink2URL: http://search.murata.co.jp/Ceramy/image/img/A01X/G101/ENG/GRM155R61A224KE19-01.pdf; DatasheetVersion: 03/2016; Length: 1 mm; Max Operating Temperature: 85 degC; Min Operating Temperature: -55 degC; Mounting Technology: Surface Mount; Package Quantity: 1; PackageDescription: 2-Pin Surface Mount Device, Body 1 x 0.5 mm; Packaging: Tape and Reel; PartNumber: GRM155R61A224KE19D; RoHSCompliant: true; Tolerance: 10%; Width: 0.5 mm; Height: 0.5 mm; Mount: Surface Mount; PackageReference: 0402; Pins: 2; Radiation Hardening: No; REACH SVHC: No SVHC; Voltage Rating (DC): 10 V
C91 = E7: Chip Capacitor, 220 nF, +/- 10%, 10 V, -55 to 85 degC, 0402 (1005 Metric), RoHS, Tape and Reel; Manufacturer: Basic Passives; Тип элемента: Конденсатор; Capacitance: 220 nF; Case\/Package: 0402; Type (Capacitors): X5R; Voltage Rating: 10 V; Old_des: C493; New_des: C91; UID: E7; Component Kind: Standard; Case Code (Imperial): 0402; Case Code (Metric): 1005; ComponentLink1Description: Manufacturer URL; ComponentLink1URL: http://www.murata.com/; ComponentLink2Description: Datasheet; ComponentLink2URL: http://search.murata.co.jp/Ceramy/image/img/A01X/G101/ENG/GRM155R61A224KE19-01.pdf; DatasheetVersion: 03/2016; Length: 1 mm; Max Operating Temperature: 85 degC; Min Operating Temperature: -55 degC; Mounting Technology: Surface Mount; Package Quantity: 1; PackageDescription: 2-Pin Surface Mount Device, Body 1 x 0.5 mm; Packaging: Tape and Reel; PartNumber: GRM155R61A224KE19D; RoHSCompliant: true; Tolerance: 10%; Width: 0.5 mm; Height: 0.5 mm; Mount: Surface Mount; PackageReference: 0402; Pins: 2; Radiation Hardening: No; REACH SVHC: No SVHC; Voltage Rating (DC): 10 V
C92 = E7: Chip Capacitor, 220 nF, +/- 10%, 10 V, -55 to 85 degC, 0402 (1005 Metric), RoHS, Tape and Reel; Manufacturer: Basic Passives; Тип элемента: Конденсатор; Capacitance: 220 nF; Case\/Package: 0402; Type (Capacitors): X5R; Voltage Rating: 10 V; Old_des: C494; New_des: C92; UID: E7; Component Kind: Standard; Case Code (Imperial): 0402; Case Code (Metric): 1005; ComponentLink1Description: Manufacturer URL; ComponentLink1URL: http://www.murata.com/; ComponentLink2Description: Datasheet; ComponentLink2URL: http://search.murata.co.jp/Ceramy/image/img/A01X/G101/ENG/GRM155R61A224KE19-01.pdf; DatasheetVersion: 03/2016; Length: 1 mm; Max Operating Temperature: 85 degC; Min Operating Temperature: -55 degC; Mounting Technology: Surface Mount; Package Quantity: 1; PackageDescription: 2-Pin Surface Mount Device, Body 1 x 0.5 mm; Packaging: Tape and Reel; PartNumber: GRM155R61A224KE19D; RoHSCompliant: true; Tolerance: 10%; Width: 0.5 mm; Height: 0.5 mm; Mount: Surface Mount; PackageReference: 0402; Pins: 2; Radiation Hardening: No; REACH SVHC: No SVHC; Voltage Rating (DC): 10 V
C93 = E7: Chip Capacitor, 220 nF, +/- 10%, 10 V, -55 to 85 degC, 0402 (1005 Metric), RoHS, Tape and Reel; Manufacturer: Basic Passives; Тип элемента: Конденсатор; Capacitance: 220 nF; Case\/Package: 0402; Type (Capacitors): X5R; Voltage Rating: 10 V; Old_des: C495; New_des: C93; UID: E7; Component Kind: Standard; Case Code (Imperial): 0402; Case Code (Metric): 1005; ComponentLink1Description: Manufacturer URL; ComponentLink1URL: http://www.murata.com/; ComponentLink2Description: Datasheet; ComponentLink2URL: http://search.murata.co.jp/Ceramy/image/img/A01X/G101/ENG/GRM155R61A224KE19-01.pdf; DatasheetVersion: 03/2016; Length: 1 mm; Max Operating Temperature: 85 degC; Min Operating Temperature: -55 degC; Mounting Technology: Surface Mount; Package Quantity: 1; PackageDescription: 2-Pin Surface Mount Device, Body 1 x 0.5 mm; Packaging: Tape and Reel; PartNumber: GRM155R61A224KE19D; RoHSCompliant: true; Tolerance: 10%; Width: 0.5 mm; Height: 0.5 mm; Mount: Surface Mount; PackageReference: 0402; Pins: 2; Radiation Hardening: No; REACH SVHC: No SVHC; Voltage Rating (DC): 10 V
C94 = E7: Chip Capacitor, 220 nF, +/- 10%, 10 V, -55 to 85 degC, 0402 (1005 Metric), RoHS, Tape and Reel; Manufacturer: Basic Passives; Тип элемента: Конденсатор; Capacitance: 220 nF; Case\/Package: 0402; Type (Capacitors): X5R; Voltage Rating: 10 V; Old_des: C496; New_des: C94; UID: E7; Component Kind: Standard; Case Code (Imperial): 0402; Case Code (Metric): 1005; ComponentLink1Description: Manufacturer URL; ComponentLink1URL: http://www.murata.com/; ComponentLink2Description: Datasheet; ComponentLink2URL: http://search.murata.co.jp/Ceramy/image/img/A01X/G101/ENG/GRM155R61A224KE19-01.pdf; DatasheetVersion: 03/2016; Length: 1 mm; Max Operating Temperature: 85 degC; Min Operating Temperature: -55 degC; Mounting Technology: Surface Mount; Package Quantity: 1; PackageDescription: 2-Pin Surface Mount Device, Body 1 x 0.5 mm; Packaging: Tape and Reel; PartNumber: GRM155R61A224KE19D; RoHSCompliant: true; Tolerance: 10%; Width: 0.5 mm; Height: 0.5 mm; Mount: Surface Mount; PackageReference: 0402; Pins: 2; Radiation Hardening: No; REACH SVHC: No SVHC; Voltage Rating (DC): 10 V
C95 = E7: Chip Capacitor, 220 nF, +/- 10%, 10 V, -55 to 85 degC, 0402 (1005 Metric), RoHS, Tape and Reel; Manufacturer: Basic Passives; Тип элемента: Конденсатор; Capacitance: 220 nF; Case\/Package: 0402; Type (Capacitors): X5R; Voltage Rating: 10 V; Old_des: C497; New_des: C95; UID: E7; Component Kind: Standard; Case Code (Imperial): 0402; Case Code (Metric): 1005; ComponentLink1Description: Manufacturer URL; ComponentLink1URL: http://www.murata.com/; ComponentLink2Description: Datasheet; ComponentLink2URL: http://search.murata.co.jp/Ceramy/image/img/A01X/G101/ENG/GRM155R61A224KE19-01.pdf; DatasheetVersion: 03/2016; Length: 1 mm; Max Operating Temperature: 85 degC; Min Operating Temperature: -55 degC; Mounting Technology: Surface Mount; Package Quantity: 1; PackageDescription: 2-Pin Surface Mount Device, Body 1 x 0.5 mm; Packaging: Tape and Reel; PartNumber: GRM155R61A224KE19D; RoHSCompliant: true; Tolerance: 10%; Width: 0.5 mm; Height: 0.5 mm; Mount: Surface Mount; PackageReference: 0402; Pins: 2; Radiation Hardening: No; REACH SVHC: No SVHC; Voltage Rating (DC): 10 V
C96 = E7: Chip Capacitor, 220 nF, +/- 10%, 10 V, -55 to 85 degC, 0402 (1005 Metric), RoHS, Tape and Reel; Manufacturer: Basic Passives; Тип элемента: Конденсатор; Capacitance: 220 nF; Case\/Package: 0402; Type (Capacitors): X5R; Voltage Rating: 10 V; Old_des: C498; New_des: C96; UID: E7; Component Kind: Standard; Case Code (Imperial): 0402; Case Code (Metric): 1005; ComponentLink1Description: Manufacturer URL; ComponentLink1URL: http://www.murata.com/; ComponentLink2Description: Datasheet; ComponentLink2URL: http://search.murata.co.jp/Ceramy/image/img/A01X/G101/ENG/GRM155R61A224KE19-01.pdf; DatasheetVersion: 03/2016; Length: 1 mm; Max Operating Temperature: 85 degC; Min Operating Temperature: -55 degC; Mounting Technology: Surface Mount; Package Quantity: 1; PackageDescription: 2-Pin Surface Mount Device, Body 1 x 0.5 mm; Packaging: Tape and Reel; PartNumber: GRM155R61A224KE19D; RoHSCompliant: true; Tolerance: 10%; Width: 0.5 mm; Height: 0.5 mm; Mount: Surface Mount; PackageReference: 0402; Pins: 2; Radiation Hardening: No; REACH SVHC: No SVHC; Voltage Rating (DC): 10 V
C97 = E7: Chip Capacitor, 220 nF, +/- 10%, 10 V, -55 to 85 degC, 0402 (1005 Metric), RoHS, Tape and Reel; Manufacturer: Basic Passives; Тип элемента: Конденсатор; Capacitance: 220 nF; Case\/Package: 0402; Type (Capacitors): X5R; Voltage Rating: 10 V; Old_des: C499; New_des: C97; UID: E7; Component Kind: Standard; Case Code (Imperial): 0402; Case Code (Metric): 1005; ComponentLink1Description: Manufacturer URL; ComponentLink1URL: http://www.murata.com/; ComponentLink2Description: Datasheet; ComponentLink2URL: http://search.murata.co.jp/Ceramy/image/img/A01X/G101/ENG/GRM155R61A224KE19-01.pdf; DatasheetVersion: 03/2016; Length: 1 mm; Max Operating Temperature: 85 degC; Min Operating Temperature: -55 degC; Mounting Technology: Surface Mount; Package Quantity: 1; PackageDescription: 2-Pin Surface Mount Device, Body 1 x 0.5 mm; Packaging: Tape and Reel; PartNumber: GRM155R61A224KE19D; RoHSCompliant: true; Tolerance: 10%; Width: 0.5 mm; Height: 0.5 mm; Mount: Surface Mount; PackageReference: 0402; Pins: 2; Radiation Hardening: No; REACH SVHC: No SVHC; Voltage Rating (DC): 10 V
R23 = E99: Chip Resistor, 4.7 KOhm, +/- 1%, 0.1 W, -55 to 155 degC, 0402 (1005 Metric), RoHS, Tape and Reel; Тип элемента: Резистор; Case\/Package: 0402; Voltage Rating: 50 V; Power Rating: 100 mW; Old_des: R332; New_des: R23; UID: E99; Component Kind: Standard; Case Code (Imperial): 0402; Case Code (Metric): 1005; ComponentLink1Description: Manufacturer URL; ComponentLink1URL: http://www.panasonic.com/; ComponentLink2Description: Datasheet; ComponentLink2URL: http://industrial.panasonic.com/cdbs/www-data/pdf/RDA0000/AOA0000C86.pdf; DatasheetVersion: 04/2015; Length: 1 mm; Max Operating Temperature: 155 degC; Min Operating Temperature: -55 degC; Mounting Technology: Surface Mount; Package Quantity: 1; PackageDescription: 2-Pin Surface Mount Device, Body 1 x 0.5 mm; Packaging: Cut Tape; PartNumber: ERJ-2RKF4701X; RoHSCompliant: true; Tolerance: 1%; Width: 0.5 mm; Height: 0.35 mm; Mount: Surface Mount; PackageReference: 0402; Pins: 2; Radiation Hardening: No; REACH SVHC: Yes; Resistance: 4.7 KOhm
XS2 = E41: Female Header, Pitch 1 mm, 98 Positions, 4 Rows, Height 11 mm, Tail Length 2.31 mm, -55 to 125 degC, RoHS; Manufacturer: Samtec; Тип элемента: Соединитель; Old_des: J14; New_des: XS2; UID: E41; Component Kind: Standard; ComponentLink1Description: Manufacturer URL; ComponentLink1URL: http://www.samtec.com/; ComponentLink2Description: Datasheet; ComponentLink2URL: http://suddendocs.samtec.com/catalog_english/pcie.pdf; DatasheetVersion: Rev. 21JAN16; Mounting Technology: Through Hole; PackageDescription: Female Header, Pitch 1 mm, 98 Positions, 4 Rows, Height 11 mm, Tail Length 2.31 mm; PartNumber: PCIE-098-02-F-D-TH; PackageReference: PCIE-098-02-F-D-TH; ComponentLink3Description: Package Specification; ComponentLink3URL: http://suddendocs.samtec.com/prints/pcie-xxx-02-x-d-th-footprint.pdf